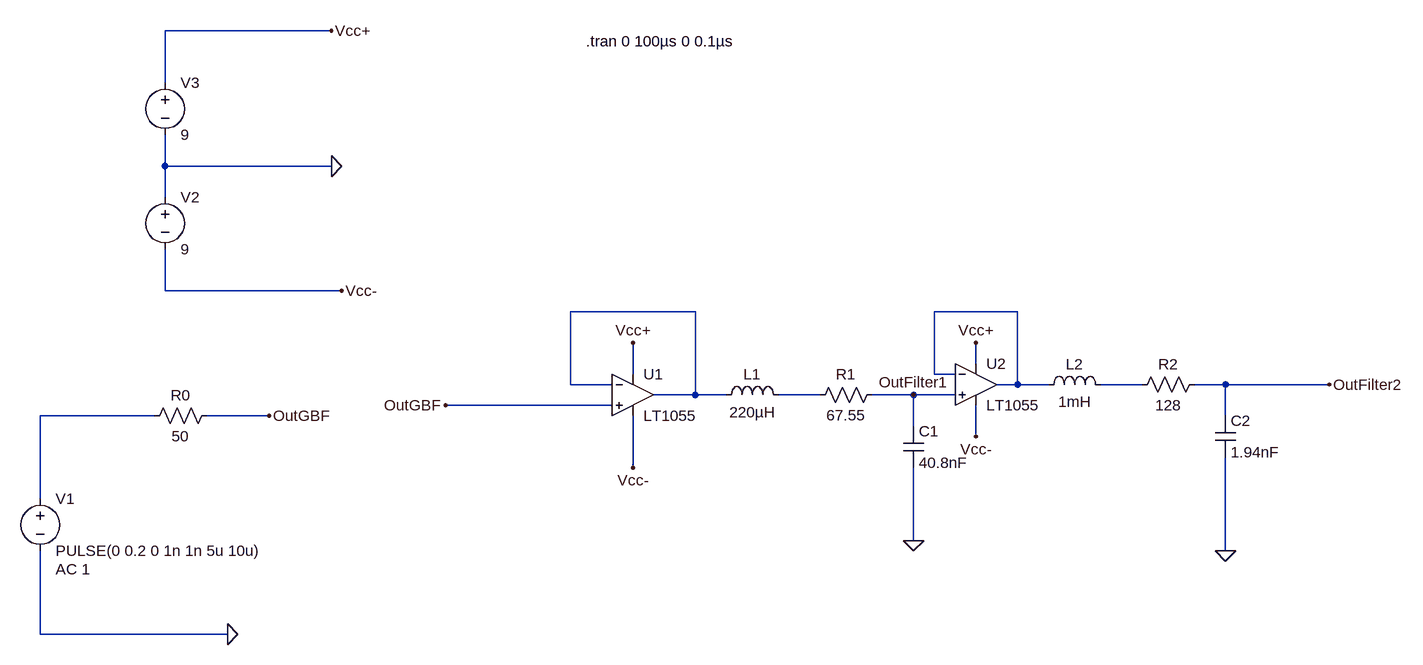
[diagram p0: schematic Draft1.asc]
Draft1.asc, the LTspice schematic file:
Version 4
SHEET 1 1144 784
WIRE -528 -368 -784 -368
WIRE -784 -288 -784 -368
WIRE -784 -160 -784 -208
WIRE -528 -160 -784 -160
WIRE -784 -112 -784 -160
WIRE -784 32 -784 -32
WIRE -512 32 -784 32
WIRE 32 64 -160 64
WIRE 528 64 400 64
WIRE 464 144 464 112
WIRE -64 160 -64 112
WIRE 400 160 400 64
WIRE 432 160 400 160
WIRE -160 176 -160 64
WIRE -96 176 -160 176
WIRE 528 176 528 64
WIRE 528 176 496 176
WIRE 576 176 528 176
WIRE 720 176 656 176
WIRE 848 176 800 176
WIRE 1008 176 848 176
WIRE 32 192 32 64
WIRE 32 192 -32 192
WIRE 80 192 32 192
WIRE 224 192 160 192
WIRE 368 192 304 192
WIRE 432 192 368 192
WIRE -96 208 -352 208
WIRE -800 224 -976 224
WIRE -624 224 -720 224
WIRE 848 224 848 176
WIRE 368 240 368 192
WIRE 464 256 464 208
WIRE -64 304 -64 224
WIRE -976 352 -976 224
WIRE 368 416 368 304
WIRE 848 432 848 288
WIRE -976 560 -976 432
WIRE -688 560 -976 560
FLAG -528 -160 0
FLAG -688 560 0
FLAG 368 416 0
FLAG 848 432 0
FLAG -528 -368 Vcc+
FLAG -64 112 Vcc+
FLAG 464 112 Vcc+
FLAG -512 32 Vcc-
FLAG -64 304 Vcc-
FLAG 464 256 Vcc-
FLAG -624 224 OutGBF
FLAG -352 208 OutGBF
FLAG 368 192 OutFilter1
FLAG 1008 176 OutFilter2
SYMBOL OpAmps\\LT1055 -64 128 R0
SYMATTR InstName U1
SYMBOL ind 64 208 R270
WINDOW 0 32 56 VTop 2
WINDOW 3 5 56 VBottom 2
SYMATTR InstName L1
SYMATTR Value 220µH
SYMBOL res 320 176 R90
WINDOW 0 0 56 VBottom 2
WINDOW 3 32 56 VTop 2
SYMATTR InstName R1
SYMATTR Value 67.55
SYMBOL cap 352 240 R0
SYMATTR InstName C1
SYMATTR Value 40.8nF
SYMBOL OpAmps\\LT1055 464 112 R0
SYMATTR InstName U2
SYMBOL ind 560 192 R270
WINDOW 0 32 56 VTop 2
WINDOW 3 5 56 VBottom 2
SYMATTR InstName L2
SYMATTR Value 1mH
SYMBOL res 816 160 R90
WINDOW 0 0 56 VBottom 2
WINDOW 3 32 56 VTop 2
SYMATTR InstName R2
SYMATTR Value 128
SYMBOL cap 832 224 R0
SYMATTR InstName C2
SYMATTR Value 1.94nF
SYMBOL res -704 208 R90
WINDOW 0 0 56 VBottom 2
WINDOW 3 32 56 VTop 2
SYMATTR InstName R0
SYMATTR Value 50
SYMBOL voltage -976 336 R0
WINDOW 123 24 124 Left 2
WINDOW 39 0 0 Left 0
SYMATTR Value2 AC 1
SYMATTR InstName V1
SYMATTR Value PULSE(0 0.2 0 1n 1n 5u 10u)
SYMBOL voltage -784 -128 R0
SYMATTR InstName V2
SYMATTR Value 9
SYMBOL voltage -784 -304 R0
SYMATTR InstName V3
SYMATTR Value 9
TEXT -136 -352 Left 2 !.tran 0 100µs 0 0.1µs

The netlist it stands for:
* Draft1.asc
XU1 OutGBF N001 Vcc+ Vcc- N001 LT1055  ; pins In+ In- V+ V- OUT
L1 N001 N004 220µH
R1 OutFilter1 N004 67.55
C1 OutFilter1 0 40.8nF
XU2 OutFilter1 N002 Vcc+ Vcc- N002 LT1055  ; pins In+ In- V+ V- OUT
L2 N002 N003 1mH
R2 OutFilter2 N003 128
C2 OutFilter2 0 1.94nF
R0 OutGBF N005 50
V1 N005 0 PULSE(0 0.2 0 1n 1n 5u 10u) AC 1
V2 0 Vcc- 9
V3 Vcc+ 0 9
.tran 0 100µs 0 0.1µs
.backanno
.end

* Results of the author's LTspice run, read from the files saved beside the schematic
* Operating Point, zero values left out:
*   V(vcc+) = 9 V
*   V(vcc-) = -9 V
*   I(V3) = -5.6 mA
*   I(V2) = -5.6 mA
*   Ix(u1:3) = 2.8 mA
*   Ix(u1:4) = -2.8 mA
*   Ix(u2:3) = 2.8 mA
*   Ix(u2:4) = -2.8 mA
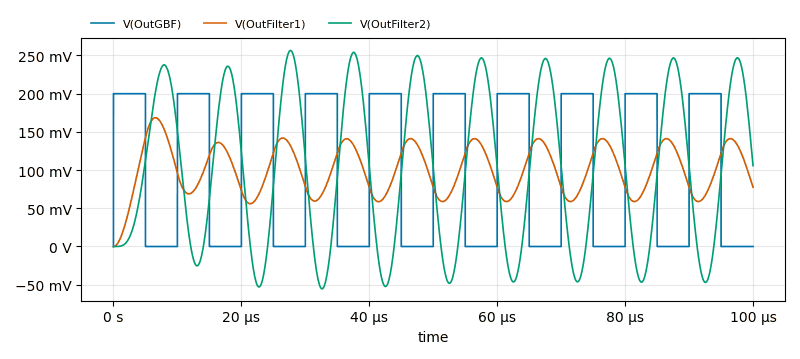
[diagram p1: Transient Analysis of Draft1.asc, plotted from the saved traces]
* Transient Analysis, 1 run:
*   V(OutGBF): min -44.14 µV, max 200 mV, average 100 mV, rms 141.4 mV, last -22.88 nV
*   V(OutFilter1): min 0 V, max 168.5 mV, average 100.2 mV, rms 105.4 mV, last 77.58 mV
*   V(OutFilter2): min -55.37 mV, max 256.7 mV, average 101.7 mV, rms 144.6 mV, last 105.8 mV